# EAGLE schematic ModWalkST (EAGLE 9.6.2)
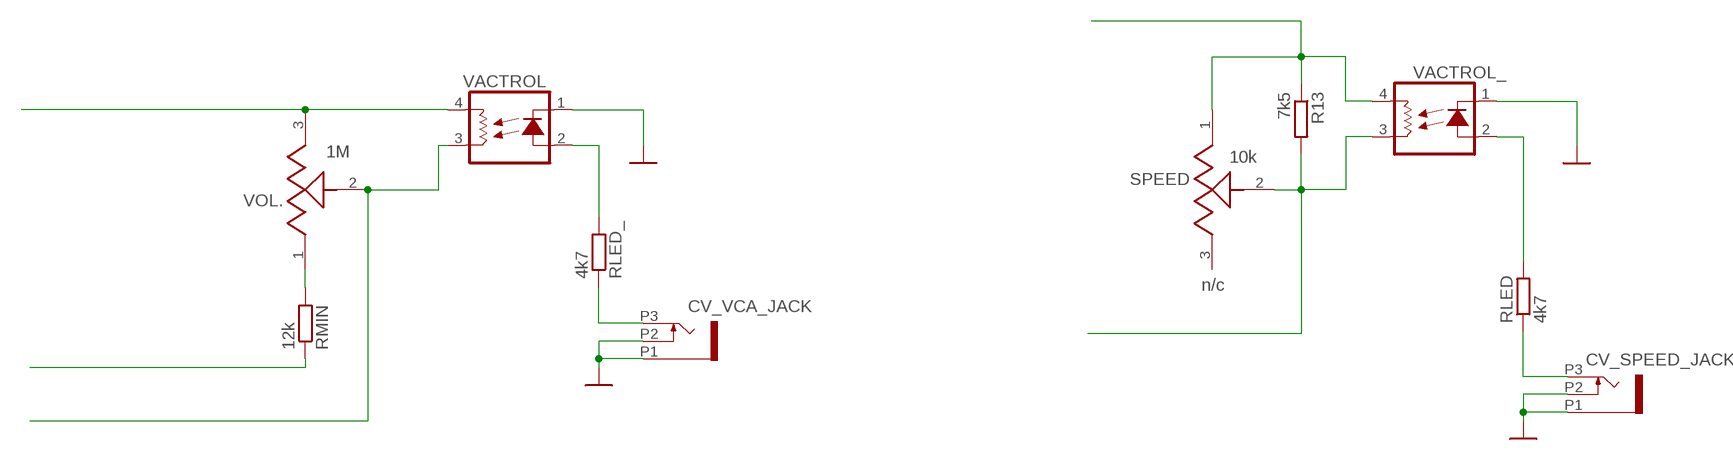
[diagram p0: schematic, sheet 1]

## Parts
CV_SPEED_JACK  PJ301_THONKICONN6  [WQP_PJ_301M6]
CV_VCA_JACK  PJ301_THONKICONN6  [WQP_PJ_301M6]
R13  7k5  R-EU_0204/5  [0204/5]
RLED  4k7  R-EU_0204/5  [0204/5]
RLED_  4k7  R-EU_0204/5  [0204/5]
RMIN  12k  R-EU_0204/5  [0204/5]
SPEED  10k  POT_VERTICAL_R1212  [POT_VERTICAL_R1212]
VACTROL  VTL5C10  [VTL5C]
VACTROL_  VTL5C10  [VTL5C]
VOL.  1M  POT_VERTICAL_R1212  [POT_VERTICAL_R1212]

## Nets
GND: CV_SPEED_JACK.P1 CV_SPEED_JACK.P2 CV_VCA_JACK.P1 CV_VCA_JACK.P2 VACTROL.1(C) VACTROL_.1(C)
N$1: VACTROL.3(L1) VOL..2
N$2: RLED_.2 VACTROL.2(A)
N$3: VACTROL.4(L2) VOL..3
N$4: CV_VCA_JACK.P3 RLED_.1
N$5: RMIN.2 VOL..1
N$6: R13.1 SPEED.1 VACTROL_.4(L2)
N$7: R13.2 SPEED.2 VACTROL_.3(L1)
N$8: RLED.2 VACTROL_.2(A)
N$9: CV_SPEED_JACK.P3 RLED.1
N$10: RMIN.1
Unconnected: SPEED.3

## Notes on the sheet
- n/c

## Library data of the parts
CV_SPEED_JACK CV_VCA_JACK = og-pj301:PJ301_THONKICONN
R13 RLED RLED_ RMIN = rcl:R-EU_: RESISTOR, European symbol
SPEED VOL. = Potenciometres:POT_VERTICAL_R1212
VACTROL VACTROL_ = optocoupler:VTL5C*: Low Cost Axial Vactrols Source: www.perkinelmer.com/opto ... vtl5c9_c10.pdf; MPN: VTL5C10; OC_FARNELL: unknown; OC_NEWARK: 98F3580